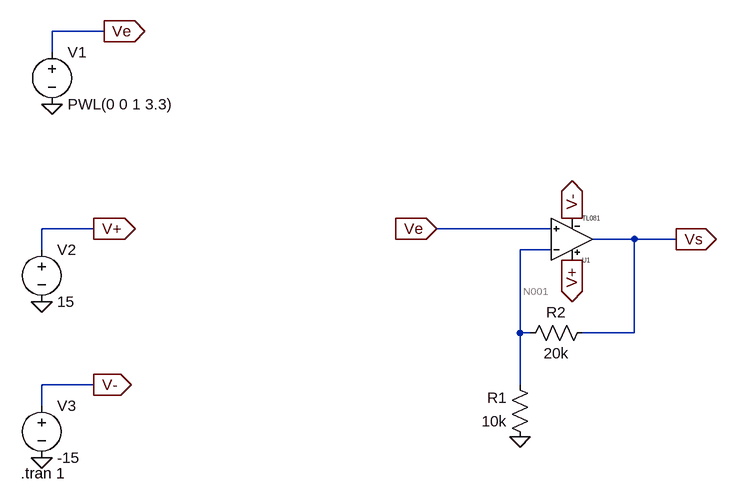
[diagram p0: schematic circuit_sim.asc]
circuit_sim.asc, the LTspice schematic file:
Version 4
SHEET 1 880 760
WIRE -304 64 -384 64
WIRE -384 96 -384 64
WIRE -320 368 -400 368
WIRE 384 368 208 368
WIRE 512 384 448 384
WIRE 576 384 512 384
WIRE -400 400 -400 368
WIRE 384 400 336 400
WIRE 336 528 336 400
WIRE 352 528 336 528
WIRE 512 528 512 384
WIRE 512 528 432 528
WIRE -320 608 -400 608
WIRE 336 608 336 528
WIRE -400 640 -400 608
FLAG -384 176 0
FLAG -304 64 Ve
IOPIN -304 64 Out
FLAG 208 368 Ve
IOPIN 208 368 In
FLAG -400 480 0
FLAG -320 368 V+
IOPIN -320 368 Out
FLAG 416 416 V+
IOPIN 416 416 Out
FLAG 576 384 Vs
IOPIN 576 384 Out
FLAG 336 688 0
FLAG -400 720 0
FLAG -320 608 V-
IOPIN -320 608 Out
FLAG 416 352 V-
IOPIN 416 352 Out
SYMBOL TL081 416 448 M180
SYMATTR InstName U1
SYMBOL voltage -384 80 R0
WINDOW 123 0 0 Left 0
WINDOW 39 0 0 Left 0
SYMATTR InstName V1
SYMATTR Value PWL(0 0 1 3.3)
SYMBOL voltage -400 384 R0
WINDOW 123 0 0 Left 0
WINDOW 39 0 0 Left 0
SYMATTR InstName V2
SYMATTR Value 15
SYMBOL res 448 512 R90
WINDOW 0 0 56 VBottom 2
WINDOW 3 32 56 VTop 2
SYMATTR InstName R2
SYMATTR Value 20k
SYMBOL res 352 704 R180
WINDOW 0 36 76 Left 2
WINDOW 3 36 40 Left 2
SYMATTR InstName R1
SYMATTR Value 10k
SYMBOL voltage -400 624 R0
WINDOW 123 0 0 Left 0
WINDOW 39 0 0 Left 0
SYMATTR InstName V3
SYMATTR Value -15
TEXT -432 744 Left 2 !.tran 1

The netlist it stands for:
* circuit_sim.asc
XU1 Ve N001 V+ V- Vs TL081  ; pins In+ In- V+ V- OUT
V1 Ve 0 PWL(0 0 1 3.3)
V2 V+ 0 15
R2 Vs N001 20k
R1 0 N001 10k
V3 V- 0 -15
.tran 1
.lib TL081.sub
.backanno
.end

* Results of the author's LTspice run, read from the files saved beside the schematic
* Operating Point, zero values left out:
*   V(vs) = 33.81 µV
*   V(v-) = -15 V
*   V(v+) = 15 V
*   V(n001) = 10.97 µV
*   I(R1) = -1.097 nA
*   I(R2) = 1.142 nA
*   I(V3) = 14.19 mA
*   I(V2) = -14.19 mA
*   I(V1) = -45.05 pA
*   Ix(u1:1) = 45.05 pA
*   Ix(u1:2) = 45.05 pA
*   Ix(u1:3) = 14.19 mA
*   Ix(u1:4) = -14.19 mA
*   Ix(u1:5) = -1.142 nA
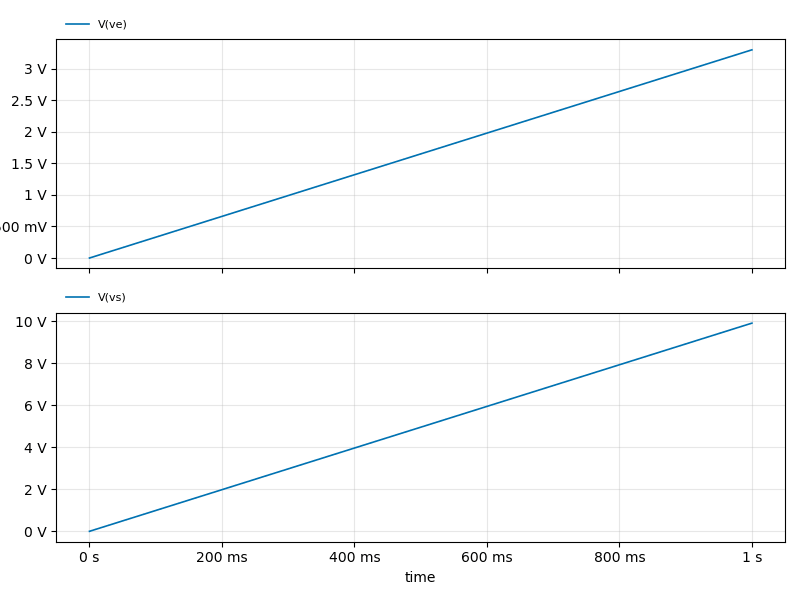
[diagram p1: Transient Analysis of circuit_sim.asc, plotted from the saved traces]
* Transient Analysis, 1 run:
*   V(ve): min 0 V, max 3.3 V, average 1.65 V, rms 2.31 V, last 3.3 V
*   V(vs): min 33.81 µV, max 9.9 V, average 4.95 V, rms 6.93 V, last 9.9 V